# Altium schematic sheet RcMPPT-MCU.SchDoc: RcMPPT-MCU
size A4; Author: Thomas Hofmann; CompanyName: HTL St.Pölten; Organization: Altium Limited; Address1: RcMPPT; Address4: Australia 2086; DocumentNumber: 1; Revision: 2.0; SheetNumber: 3; SheetTotal: 8
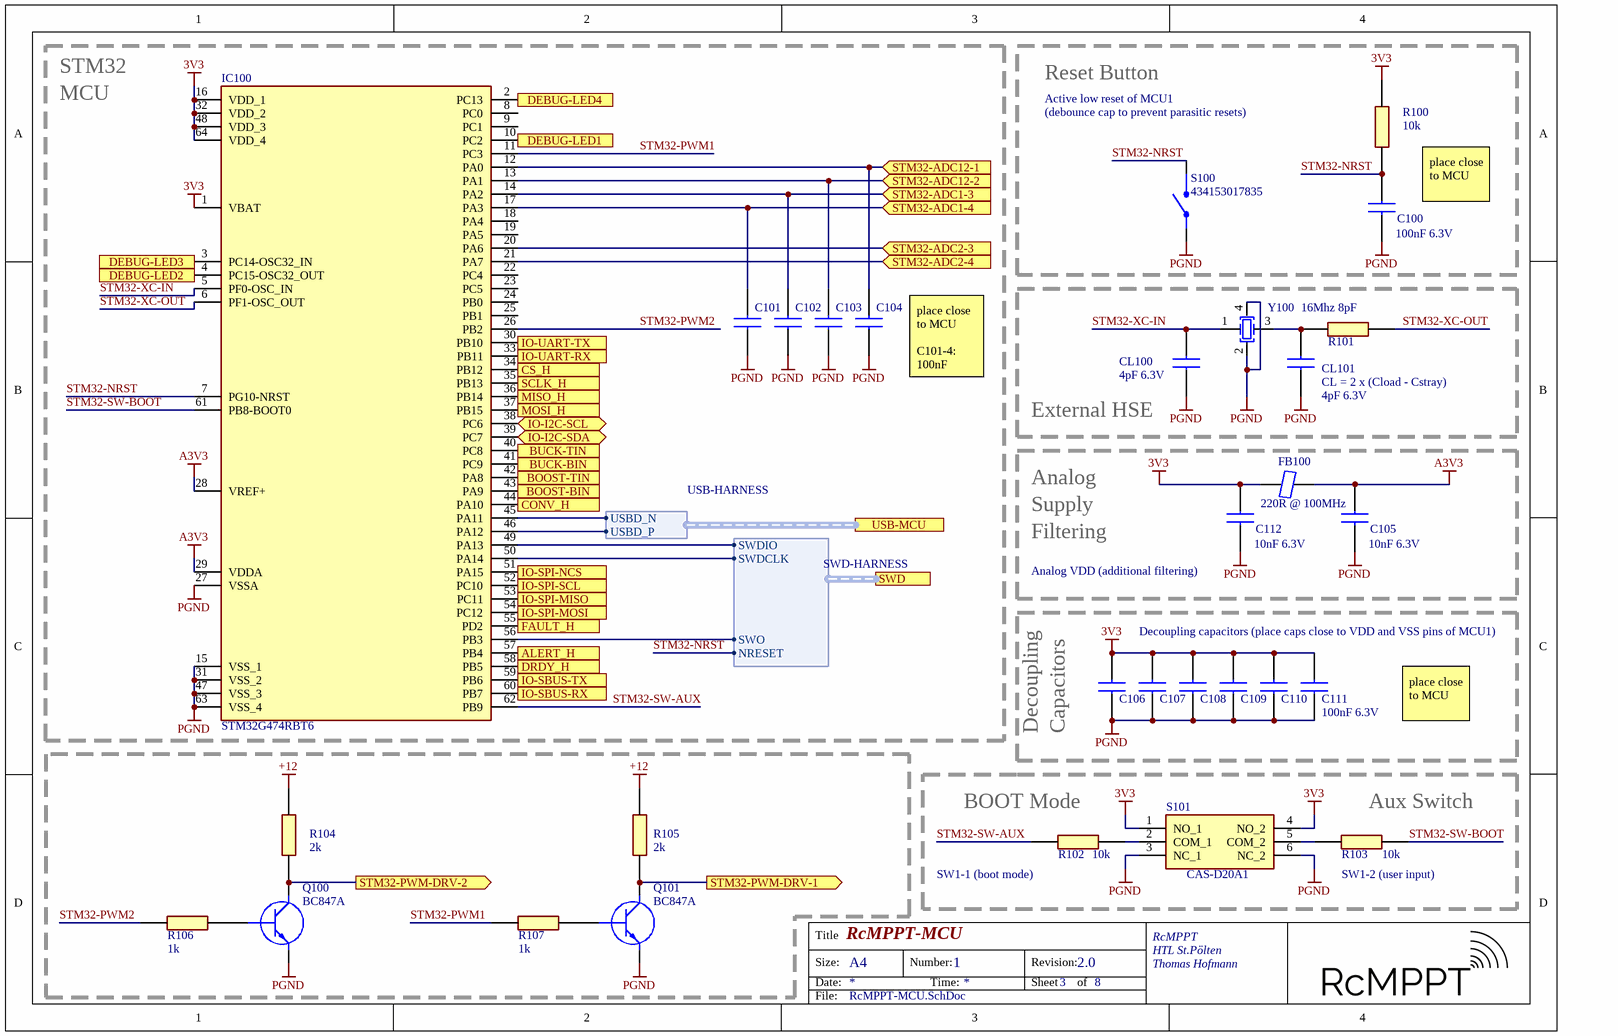
[diagram p0: RcMPPT-MCU.SchDoc]

## Parts
C100  100nF 6.3V  [CAPC1608X97N]
C101  100nF 6.3V  [CAPC1005X55N]  (value not drawn)
C102  100nF 6.3V  [CAPC1005X55N]  (value not drawn)
C103  100nF 6.3V  [CAPC1005X55N]  (value not drawn)
C104  100nF 6.3V  [CAPC1005X55N]  (value not drawn)
C105  10nF 6.3V  [CAPC1608X97N]
C106  100nF 6.3V  [CAPC1608X97N]  (value not drawn)
C107  100nF 6.3V  [CAPC1608X97N]  (value not drawn)
C108  100nF 6.3V  [CAPC1608X97N]  (value not drawn)
C109  100nF 6.3V  [CAPC1608X97N]  (value not drawn)
C110  100nF 6.3V  [CAPC1608X97N]  (value not drawn)
C111  100nF 6.3V  [CAPC1608X97N]
C112  10nF 6.3V  [CAPC1608X97N]
CL100  4pF 6.3V  [CAPC1608X97N]
CL101  4pF 6.3V  [CAPC1608X97N]
FB100  220R @ 100MHz  [FB0603]
IC100  STM32G474RBT6  [QFP50P1200X1200X160-64N]
Q100  BC847A  [SOT95P230X110-3N]
Q101  BC847A  [SOT95P230X110-3N]
R100  10k  [RESC1608X50N]
R101  22R  [RESC1005X40N]  (value not drawn)
R102  10k  [RESC1608X50N]
R103  10k  [RESC1608X50N]
R104  2k  [RESC1608X50N]
R105  2k  [RESC1608X50N]
R106  1k  [RESC1608X50N]
R107  1k  [RESC1608X50N]
S100  434153017835  [434153017835]
S101  CAS-D20A1  [CASD20A1]
Y100  16Mhz 8pF  [ABM8W160000MHZ8B1UT3]

## Blocks framed on the sheet
Reset Button: C100 R100 S100
External HSE: CL100 CL101 R101 Y100

## Ports
ALERT_H (in), BOOST-BIN (out), BOOST-TIN (out), BUCK-BIN (out), BUCK-TIN (out), CONV_H (out), CS_H (out), DEBUG-LED1 (out), DEBUG-LED2 (out), DEBUG-LED3 (out), DEBUG-LED4 (out), DRDY_H (in), FAULT_H (in), IO-I2C-SCL (bidir), IO-I2C-SDA (bidir), IO-SBUS-RX (in), IO-SBUS-TX (out), IO-SPI-MISO (in), IO-SPI-MOSI (out), IO-SPI-NCS (out), IO-SPI-SCL (out), IO-UART-RX (in), IO-UART-TX (out), MISO_H (in), MOSI_H (out), SCLK_H (out), STM32-ADC1-3 (in), STM32-ADC1-4 (in), STM32-ADC2-3 (in), STM32-ADC2-4 (in), STM32-ADC12-1 (in), STM32-ADC12-2 (in), STM32-PWM-DRV-1 (out), STM32-PWM-DRV-2 (out), SWD (harness SWD-HARNESS), USB-MCU (harness USB-HARNESS)

## Harnesses
USB-HARNESS: USBD_P, USBD_N
SWD-HARNESS: SWDIO, SWDCLK, SWO, NRESET

## Nets
3V3: C106.1 C107.1 C108.1 C109.1 C110.1 C111.1 C112.1 FB100.1 IC100.1(VBAT) IC100.16(VDD_1) IC100.32(VDD_2) IC100.48(VDD_3) IC100.64(VDD_4) R100.1 S101.1(NO_1) S101.4(NO_2)
+12: R104.2 R105.2
A3V3: C105.1 FB100.2 IC100.28(VREF+) IC100.29(VDDA)
PGND: C100.2 C101.1 C102.1 C103.1 C104.1 C105.2 C106.2 C107.2 C108.2 C109.2 C110.2 C111.2 C112.2 CL100.1 CL101.1 IC100.15(VSS_1) IC100.27(VSSA) IC100.31(VSS_2) IC100.47(VSS_3) IC100.63(VSS_4) Q100.2(E) Q101.2(E) S100.1,4(NO) S101.3(NC_1) S101.6(NC_2) Y100.2(OSC2) Y100.4
ALERT_H: IC100.57(PB4) ; port ALERT_H
BOOST-BIN: IC100.43(PA9) ; port BOOST-BIN
BOOST-TIN: IC100.42(PA8) ; port BOOST-TIN
BUCK-BIN: IC100.41(PC9) ; port BUCK-BIN
BUCK-TIN: IC100.40(PC8) ; port BUCK-TIN
CONV_H: IC100.44(PA10) ; port CONV_H
CS_H: IC100.34(PB12) ; port CS_H
DEBUG-LED1: IC100.10(PC2) ; port DEBUG-LED1
DEBUG-LED2: IC100.4(PC15-OSC32_OUT) ; port DEBUG-LED2
DEBUG-LED3: IC100.3(PC14-OSC32_IN) ; port DEBUG-LED3
DEBUG-LED4: IC100.2(PC13) ; port DEBUG-LED4
DRDY_H: IC100.58(PB5) ; port DRDY_H
FAULT_H: IC100.55(PD2) ; port FAULT_H
IO-I2C-SCL: IC100.38(PC6) ; port IO-I2C-SCL
IO-I2C-SDA: IC100.39(PC7) ; port IO-I2C-SDA
IO-SBUS-RX: IC100.60(PB7) ; port IO-SBUS-RX
IO-SBUS-TX: IC100.59(PB6) ; port IO-SBUS-TX
IO-SPI-MISO: IC100.53(PC11) ; port IO-SPI-MISO
IO-SPI-MOSI: IC100.54(PC12) ; port IO-SPI-MOSI
IO-SPI-NCS: IC100.51(PA15) ; port IO-SPI-NCS
IO-SPI-SCL: IC100.52(PC10) ; port IO-SPI-SCL
IO-UART-RX: IC100.33(PB11) ; port IO-UART-RX
IO-UART-TX: IC100.30(PB10) ; port IO-UART-TX
MISO_H: IC100.36(PB14) ; port MISO_H
MOSI_H: IC100.37(PB15) ; port MOSI_H
SCLK_H: IC100.35(PB13) ; port SCLK_H
STM32-ADC1-3: C102.2 IC100.14(PA2) ; port STM32-ADC1-3
STM32-ADC1-4: C101.2 IC100.17(PA3) ; port STM32-ADC1-4
STM32-ADC2-3: IC100.20(PA6) ; port STM32-ADC2-3
STM32-ADC2-4: IC100.21(PA7) ; port STM32-ADC2-4
STM32-ADC12-1: C104.2 IC100.12(PA0) ; port STM32-ADC12-1
STM32-ADC12-2: C103.2 IC100.13(PA1) ; port STM32-ADC12-2
STM32-NRST: C100.1 IC100.7(PG10-NRST) R100.2 S100.2,3(COM) ; port SWD.NRESET
STM32-PWM1: IC100.11(PC3) R107.2
STM32-PWM2: IC100.26(PB2) R106.2
STM32-PWM-DRV-1: Q101.3(C) R105.1 ; port STM32-PWM-DRV-1
STM32-PWM-DRV-2: Q100.3(C) R104.1 ; port STM32-PWM-DRV-2
STM32-SW-AUX: IC100.62(PB9) R102.2
STM32-SW-BOOT: IC100.61(PB8-BOOT0) R103.2
STM32-XC-IN: CL100.2 IC100.5(PF0-OSC_IN) Y100.1(OSC1)
STM32-XC-OUT: IC100.6(PF1-OSC_OUT) R101.2
NetCL101_2: CL101.2 R101.1 Y100.3
NetIC100_45: IC100.45(PA11) ; port USB-MCU.USBD_N
NetIC100_46: IC100.46(PA12) ; port USB-MCU.USBD_P
NetIC100_49: IC100.49(PA13) ; port SWD.SWDIO
NetIC100_50: IC100.50(PA14) ; port SWD.SWDCLK
NetIC100_56: IC100.56(PB3) ; port SWD.SWO
NetQ100_1: Q100.1(B) R106.1
NetQ101_1: Q101.1(B) R107.1
NetR102_1: R102.1 S101.2(COM_1)
NetR103_1: R103.1 S101.5(COM_2)

Not connected (* = marked no-connect by the designer): IC100 8(PC0) 9(PC1) 18(PA4) 19(PA5) 22(PC4) 23(PC5) 24(PB0) 25(PB1)

## Notes on the sheet
- STM32
- MCU
- Active low reset of MCU1
- (debounce cap to prevent parasitic resets)
- place close to MCU
- (near C104) place close to MCU
  C101-4: 100nF
- (near CL101) CL = 2 x (Cload - Cstray)
- Analog
- Supply
- (near C112) Analog VDD (additional filtering)
- Filtering
- Decoupling capacitors (place caps close to VDD and VSS pins of MCU1)
- Decoupling
- (near C106) Capacitors
- (near R102) BOOT Mode
- (near R103) Aux Switch
- (near R102) SW1-1 (boot mode)
- (near R103) SW1-2 (user input)
- Title
- Size:
- Date:
- A4
- Number:
- Time:
- Revision:
- Sheet
- of
- RcMPPT
- File:

## Library data of the parts
C100 C105-C112 CL100 CL101 = C0603: Capacitor; Height: 0.97
C101-C104 = C0402: Capacitor
FB100 = FB0603: Ferrite Bead; Height: 0.75mm
IC100 = STM32G474RBT6: Integrated Circuit; Manufacturer_Name: STMicroelectronics; Datasheet Link: https://www.mouser.com/datasheet/2/389/stm32g474cb-1600828.pdf; Height: 1.6mm; Manufacturer_Part_Number: STM32G474RBT6; Mouser Part Number: 511-STM32G474RBT6; Mouser Price/Stock: https://www.mouser.co.uk/ProductDetail/STMicroelectronics/STM32G474RBT6?qs=uwxL4vQweFP0uAZUZXLBhQ%3D%3D
Q100 Q101 = BC847A,235: Transistor BJT NPN; Manufacturer_Name: Nexperia; Datasheet Link: http://assets.nexperia.com/documents/data-sheet/BC847_SER.pdf; Height: 1.1mm; Manufacturer_Part_Number: BC847A,235; Mouser Part Number: 771-BC847A235; Mouser Price/Stock: https://www.mouser.co.uk/ProductDetail/Nexperia/BC847A235?qs=me8TqzrmIYWeD%252BqPzufrRA%3D%3D; Arrow Part Number: BC847A,235; Arrow Price/Stock: https://www.arrow.com/en/products/bc847a235/nexperia
R100 R102-R107 = R0603: Resistor; Height: 0.55mm
R101 = R0402: Resistor; Height: 0.4mm
S100 = SW-SPST: Switch
S101 = CAS-D20A1: Switch; Manufacturer_Name: Copal Electronics; Datasheet Link: https://www.nidec-copal-electronics.com/e/catalog/switch/cas.pdf; Height: 2.5mm; Manufacturer_Part_Number: CAS-D20A1
Y100 = ABM8W-16.0000MHZ-8-B1U-T3: Crystal or Oscillator; Manufacturer_Name: ABRACON; Datasheet Link: https://abracon.com/Resonators/ABM8W.pdf; Height: 0.75mm; Manufacturer_Part_Number: ABM8W-16.0000MHZ-8-B1U-T3; Mouser Part Number: 815-8W16-8B1UT; Mouser Price/Stock: https://www.mouser.co.uk/ProductDetail/ABRACON/ABM8W-160000MHZ-8-B1U-T3?qs=5aG0NVq1C4zuwTHNFUIcqw%3D%3D; Arrow Part Number: ABM8W-16.0000MHZ-8-B1U-T3; Arrow Price/Stock: https://www.arrow.com/en/products/abm8w-16.0000mhz-8-b1u-t3/abracon